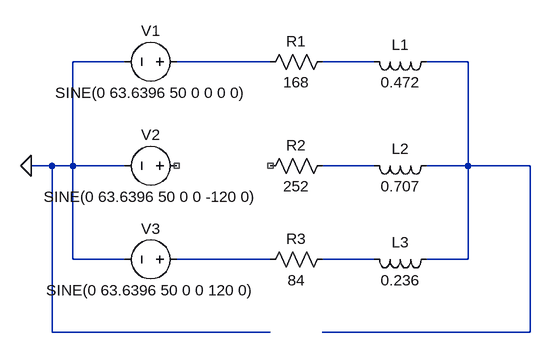
[diagram p0: schematic scheme6.asc]
scheme6.asc, the LTspice schematic file:
Version 4
SHEET 1 880 680
WIRE 128 112 48 112
WIRE 352 112 208 112
WIRE 512 112 432 112
WIRE 656 112 592 112
WIRE 16 272 -16 272
WIRE 48 272 48 112
WIRE 48 272 16 272
WIRE 128 272 48 272
WIRE 512 272 432 272
WIRE 656 272 656 112
WIRE 656 272 592 272
WIRE 752 272 656 272
WIRE 48 416 48 272
WIRE 128 416 48 416
WIRE 352 416 208 416
WIRE 512 416 432 416
WIRE 656 416 656 272
WIRE 656 416 592 416
WIRE 16 528 16 272
WIRE 352 528 16 528
WIRE 752 528 752 272
WIRE 752 528 432 528
FLAG -16 272 0
SYMBOL voltage 224 112 R90
WINDOW 0 -32 56 VBottom 2
WINDOW 3 32 56 VTop 2
WINDOW 123 0 0 Left 0
WINDOW 39 0 0 Left 0
SYMATTR InstName V1
SYMATTR Value SINE(0 63.6396 50 0 0 0 0)
SYMBOL voltage 224 272 R90
WINDOW 0 -32 56 VBottom 2
WINDOW 3 32 56 VTop 2
WINDOW 123 0 0 Left 0
WINDOW 39 0 0 Left 0
SYMATTR InstName V2
SYMATTR Value SINE(0 63.6396 50 0 0 -120 0)
SYMBOL voltage 224 416 R90
WINDOW 0 -32 56 VBottom 2
WINDOW 3 32 56 VTop 2
WINDOW 123 0 0 Left 0
WINDOW 39 0 0 Left 0
SYMATTR InstName V3
SYMATTR Value SINE(0 63.6396 50 0 0 120 0)
SYMBOL res 448 96 R90
WINDOW 0 0 56 VBottom 2
WINDOW 3 32 56 VTop 2
SYMATTR InstName R1
SYMATTR Value 168
SYMBOL res 448 256 R90
WINDOW 0 0 56 VBottom 2
WINDOW 3 32 56 VTop 2
SYMATTR InstName R2
SYMATTR Value 252
SYMBOL res 448 400 R90
WINDOW 0 0 56 VBottom 2
WINDOW 3 32 56 VTop 2
SYMATTR InstName R3
SYMATTR Value 84
SYMBOL ind 608 96 R90
WINDOW 0 5 56 VBottom 2
WINDOW 3 32 56 VTop 2
SYMATTR InstName L1
SYMATTR Value 0.472
SYMBOL ind 608 256 R90
WINDOW 0 5 56 VBottom 2
WINDOW 3 32 56 VTop 2
SYMATTR InstName L2
SYMATTR Value 0.707
SYMBOL ind 608 400 R90
WINDOW 0 5 56 VBottom 2
WINDOW 3 32 56 VTop 2
SYMATTR InstName L3
SYMATTR Value 0.236

The netlist it stands for:
* scheme6.asc
V1 N001 0 SINE(0 63.6396 50 0 0 0 0)
V2 NC_01 0 SINE(0 63.6396 50 0 0 -120 0)
V3 N005 0 SINE(0 63.6396 50 0 0 120 0)
R1 N002 N001 168
R2 N004 NC_02 252
R3 N006 N005 84
L1 N003 N002 0.472
L2 N003 N004 0.707
L3 N003 N006 0.236
.backanno
.end